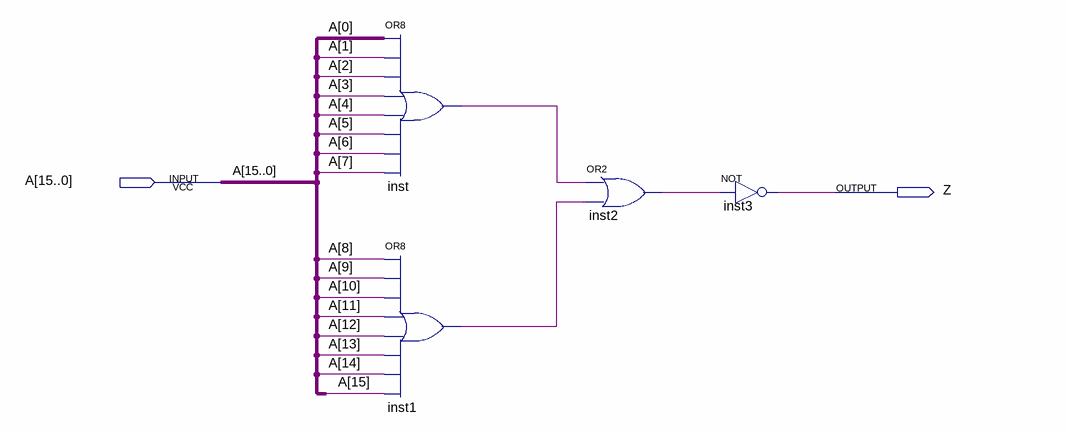
[diagram p0: schematic sheet]
// Quartus schematic cmp.bdf as structural Verilog: 4 symbols, 2 pins
module cmp (
  input  [15:0] A,
  output Z
);

  wire inst1_out, inst2_out, inst_out;

  or inst (inst_out, A[0], A[1], A[2], A[3], A[4], A[5], A[6], A[7]);
  or inst1 (inst1_out, A[8], A[9], A[10], A[11], A[12], A[13], A[14], A[15]);
  or inst2 (inst2_out, inst_out, inst1_out);
  not inst3 (Z, inst2_out);
endmodule
